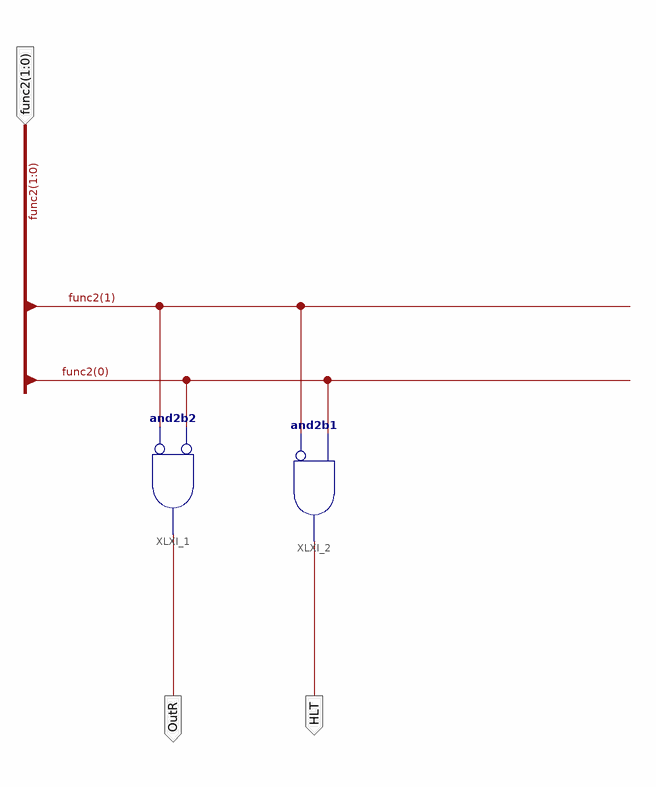
[diagram p0: schematic sheet 1]
// Xilinx ISE schematic test_decoder.sch (spartan3e) as structural Verilog: 2 symbols, 3 ports
module test_decoder (
  input  [1:0] func2,
  output OutR,
  output HLT
);

  and XLXI_1 (OutR, ~func2[1], ~func2[0]);  // and2b2
  and XLXI_2 (HLT, ~func2[1], func2[0]);  // and2b1
endmodule
